# EAGLE design USB-6002-breakout-DIO (EAGLE 9.0.1)
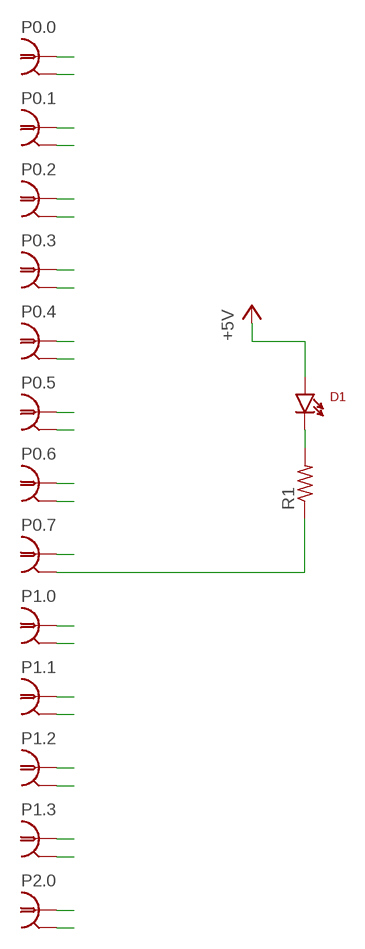
[diagram p0: schematic, sheet 1]

## Parts
D1  LED/MINI-IND  [HLMP--F0010]
P0.0  BNC-V  [BNC-V]
P0.1  BNC-V  [BNC-V]
P0.2  BNC-V  [BNC-V]
P0.3  BNC-V  [BNC-V]
P0.4  BNC-V  [BNC-V]
P0.5  BNC-V  [BNC-V]
P0.6  BNC-V  [BNC-V]
P0.7  BNC-V  [BNC-V]
P1.0  BNC-V  [BNC-V]
P1.1  BNC-V  [BNC-V]
P1.2  BNC-V  [BNC-V]
P1.3  BNC-V  [BNC-V]
P2.0  BNC-V  [BNC-V]
R1  R-US_M1206  [M1206]

## Nets
+5V: D1.A
DGND: P0.0.2 P0.1.2 P0.2.2 P0.3.2 P0.4.2 P0.5.2 P0.6.2 P0.7.2 P1.0.2 P1.1.2 P1.2.2 P1.3.2 P2.0.2 R1.1
N$1: D1.C R1.2
P0.0: P0.0.1
P0.1: P0.1.1
P0.2: P0.2.1
P0.3: P0.3.1
P0.4: P0.4.1
P0.5: P0.5.1
P0.6: P0.6.1
P0.7: P0.7.1
P1.0: P1.0.1
P1.1: P1.1.1
P1.2: P1.2.1
P1.3: P1.3.1
P2.0: P2.0.1

## Library data of the parts
D1 = Lin-Temp-Controller:LED: Through-hole, side-view LED; DIGIKEY: 516-1417-ND
P0.0 P0.1-P0.7 P1.0 P1.1-P1.3 P2.0 = connector-jqi:BNC: BNC Connector.
R1 = rcl:R-US_: RESISTOR, American symbol; SPICEPREFIX: R

## Board
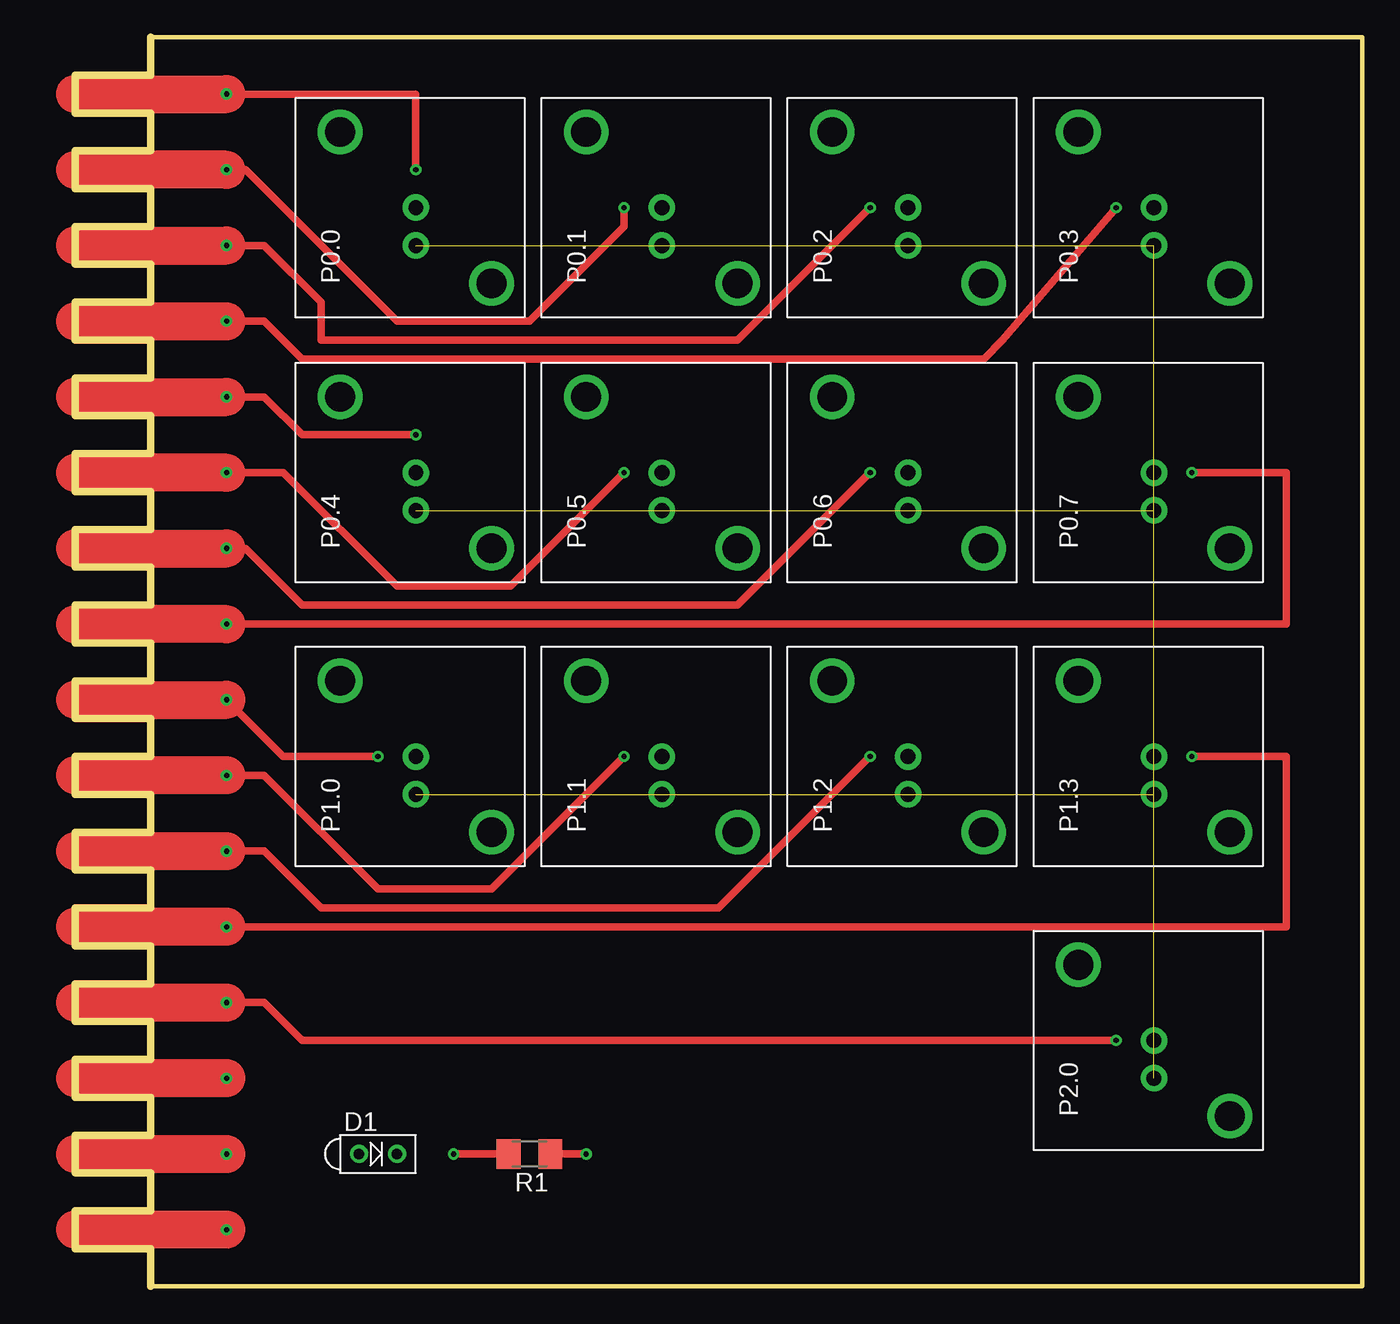
[diagram p1: board, top side]
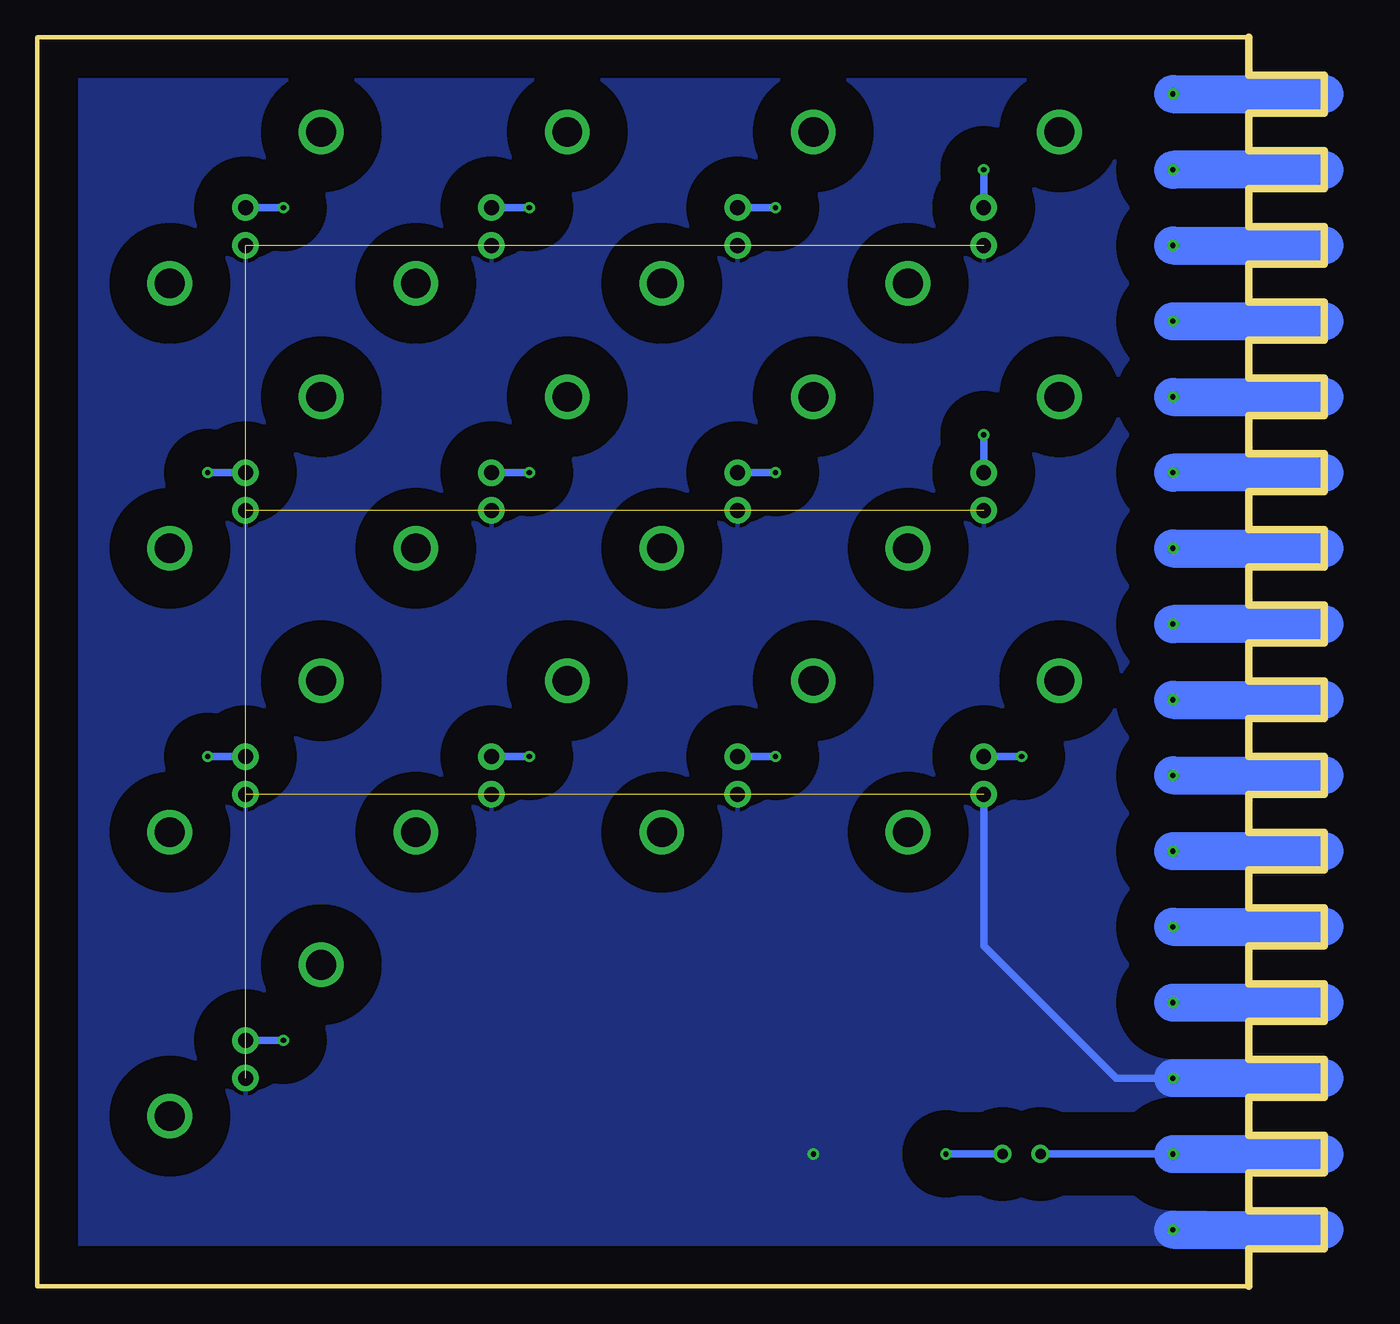
[diagram p2: board, bottom side, seen from below]

Size 86.36 x 83.82 mm. Coordinates in mm from the lower left corner, seen from the top.
Outline: 5.08,83.82 86.36,83.82 86.36,0 5.08,0 5.08,2.54 0,2.54 0,5.08 5.08,5.08 5.08,7.62 0,7.62 0,10.16 5.08,10.16 5.08,12.7 0,12.7 0,15.24 5.08,15.24 5.08,17.78 0,17.78 0,20.32 5.08,20.32 5.08,22.86 0,22.86 0,25.4 5.08,25.4 5.08,27.94 0,27.94 0,30.48 5.08,30.48 5.08,33.02 0,33.02 0,35.56 5.08,35.56 5.08,38.1 0,38.1 0,40.64 5.08,40.64 5.08,43.18 0,43.18 0,45.72 5.08,45.72 5.08,48.26 0,48.26 0,50.8 5.08,50.8 5.08,53.34 0,53.34 0,55.88 5.08,55.88 5.08,58.42 0,58.42 0,60.96 5.08,60.96 5.08,63.5 0,63.5 0,66.04 5.08,66.04 5.08,68.58 0,68.58 0,71.12 5.08,71.12 5.08,73.66 0,73.66 0,76.2 5.08,76.2 5.08,78.74 0,78.74 0,81.28 5.08,81.28 5.08,83.82
Copper layers (1*16): Top 0.035mm / dielectric 1.5mm / Bottom 0.035mm
Design rules "default": minimum track width 6mil, minimum drill 0.35mm, track to track 6mil, track to pad 6mil, pad to pad 6mil, via to via 6mil, smd to smd 6mil, copper to edge 40mil, drill to drill 6mil, minimum pad ring 10mil, minimum via ring 8mil, stop-mask expansion 4mil, vias tented up to drill 0mil, thermal gap 10mil

### Footprints (pad centres in the part's own frame; a part is rotated, then mirrored left to right if it is on the bottom)
HLMP--F0010 = drill 0.7: A 1.27,0; C -1.27,0
BNC-V = drill 1 pad 1.778: 1 0,0; 2 -2.54,0 | drill 2 pad 2.032: ANCHOR1 -5.08,-5.08; ANCHOR2 5.08,5.08
M1206 = smd 1.6 x 2: 1 -1.4,0; 2 1.4,0

### Placement (x,y rotation side)
D1  20.32,8.89 180 top
P0.0  22.86,72.39 90 top
P0.1  39.37,72.39 90 top
P0.2  55.88,72.39 90 top
P0.3  72.39,72.39 90 top
P0.4  22.86,54.61 90 top
P0.5  39.37,54.61 90 top
P0.6  55.88,54.61 90 top
P0.7  72.39,54.61 90 top
P1.0  22.86,35.56 90 top
P1.1  39.37,35.56 90 top
P1.2  55.88,35.56 90 top
P1.3  72.39,35.56 90 top
P2.0  72.39,16.51 90 top
R1  30.48,8.89 180 top

### Tracks (layer width: path | path; a pad name or v marks a point on that pad's centre or on a via)
+5V  (via drill 0.35)
  Top 2.54: 0,8.89 v10.16,8.89
  Bottom 0.508: v10.16,8.89 D1.A
  Bottom 2.54: v10.16,8.89 0,8.89
COM1
  pour Bottom (isolate 2.54): -2.54,82.55 8.89,82.55 8.89,1.27 -2.54,1.27
COM2
  pour Top (isolate 2.54): 8.89,82.55 -2.54,82.55 -2.54,1.27 8.89,1.27
DGND  (via drill 0.35)  (12 unrouted)
  Top 0.508: R1.1 v34.29,8.89
  Top 2.54: v10.16,13.97 0,13.97 | v10.16,3.81 0,3.81
  Bottom 0.508: v10.16,13.97 13.97,13.97 22.86,22.86 P1.0.2
  Bottom 2.54: 0,13.97 v10.16,13.97 | v10.16,3.81 0,3.81
  pour Bottom (isolate 2.54): 7.62,1.27 85.09,1.27 85.09,82.55 7.62,82.55
N$1  (via drill 0.35)
  Top 0.508: R1.2 v25.4,8.89
  Bottom 0.508: D1.C v25.4,8.89
P0.0  (via drill 0.35)
  Top 0.508: v10.16,80.01 22.86,80.01 v22.86,74.93
  Top 2.54: 0,80.01 v10.16,80.01
  Bottom 0.508: v22.86,74.93 P0.0.1
  Bottom 2.54: v10.16,80.01 0,80.01
P0.1  (via drill 0.35)
  Top 0.508: v10.16,74.93 11.43,74.93 21.59,64.77 30.48,64.77 36.83,71.12 v36.83,72.39
  Top 2.54: v10.16,74.93 0,74.93
  Bottom 0.508: v36.83,72.39 P0.1.1
  Bottom 2.54: 0,74.93 v10.16,74.93
P0.2  (via drill 0.35)
  Top 0.508: v10.16,69.85 12.7,69.85 16.51,66.04 16.51,63.5 44.45,63.5 v53.34,72.39
  Top 2.54: 0,69.85 v10.16,69.85
  Bottom 0.508: v53.34,72.39 P0.2.1
  Bottom 2.54: v10.16,69.85 0,69.85
P0.3  (via drill 0.35)
  Top 0.508: v69.85,72.39 62.23,63.5 60.96,62.23 15.24,62.23 12.7,64.77 v10.16,64.77
  Top 2.54: 0,64.77 v10.16,64.77
  Bottom 0.508: P0.3.1 v69.85,72.39
  Bottom 2.54: v10.16,64.77 0,64.77
P0.4  (via drill 0.35)
  Top 0.508: v10.16,59.69 12.7,59.69 15.24,57.15 v22.86,57.15
  Top 2.54: 0,59.69 v10.16,59.69
  Bottom 0.508: v22.86,57.15 P0.4.1
  Bottom 2.54: v10.16,59.69 0,59.69
P0.5  (via drill 0.35)
  Top 0.508: v36.83,54.61 29.21,46.99 21.59,46.99 13.97,54.61 v10.16,54.61
  Top 2.54: v10.16,54.61 0,54.61
  Bottom 0.508: v36.83,54.61 P0.5.1
  Bottom 2.54: 0,54.61 v10.16,54.61
P0.6  (via drill 0.35)
  Top 0.508: v10.16,49.53 11.43,49.53 15.24,45.72 44.45,45.72 v53.34,54.61
  Top 2.54: 0,49.53 v10.16,49.53
  Bottom 0.508: v53.34,54.61 P0.6.1
  Bottom 2.54: v10.16,49.53 0,49.53
P0.7  (via drill 0.35)
  Top 0.508: v10.16,44.45 81.28,44.45 81.28,54.61 v74.93,54.61
  Top 2.54: v10.16,44.45 0,44.45
  Bottom 0.508: v74.93,54.61 P0.7.1
  Bottom 2.54: 0,44.45 v10.16,44.45
P1.0  (via drill 0.35)
  Top 0.508: v10.16,39.37 13.97,35.56 v20.32,35.56
  Top 2.54: 0,39.37 v10.16,39.37
  Bottom 0.508: v20.32,35.56 P1.0.1
  Bottom 2.54: v10.16,39.37 0,39.37
P1.1  (via drill 0.35)
  Top 0.508: v10.16,34.29 12.7,34.29 20.32,26.67 27.94,26.67 v36.83,35.56
  Top 2.54: v10.16,34.29 0,34.29
  Bottom 0.508: v36.83,35.56 P1.1.1
  Bottom 2.54: v10.16,34.29 0,34.29
P1.2  (via drill 0.35)
  Top 0.508: v10.16,29.21 12.7,29.21 16.51,25.4 43.18,25.4 v53.34,35.56
  Top 2.54: 0,29.21 v10.16,29.21
  Bottom 0.508: v53.34,35.56 P1.2.1
  Bottom 2.54: v10.16,29.21 0,29.21
P1.3  (via drill 0.35)
  Top 0.508: v10.16,24.13 81.28,24.13 81.28,35.56 v74.93,35.56
  Top 2.54: v10.16,24.13 0,24.13
  Bottom 0.508: v74.93,35.56 P1.3.1
  Bottom 2.54: v10.16,24.13 0,24.13
P2.0  (via drill 0.35)
  Top 0.508: v10.16,19.05 12.7,19.05 15.24,16.51 v69.85,16.51
  Top 2.54: 0,19.05 v10.16,19.05
  Bottom 0.508: v69.85,16.51 P2.0.1
  Bottom 2.54: v10.16,19.05 0,19.05